# EAGLE design Arduino_Shield_envFollow_vs3 (EAGLE 5.06)
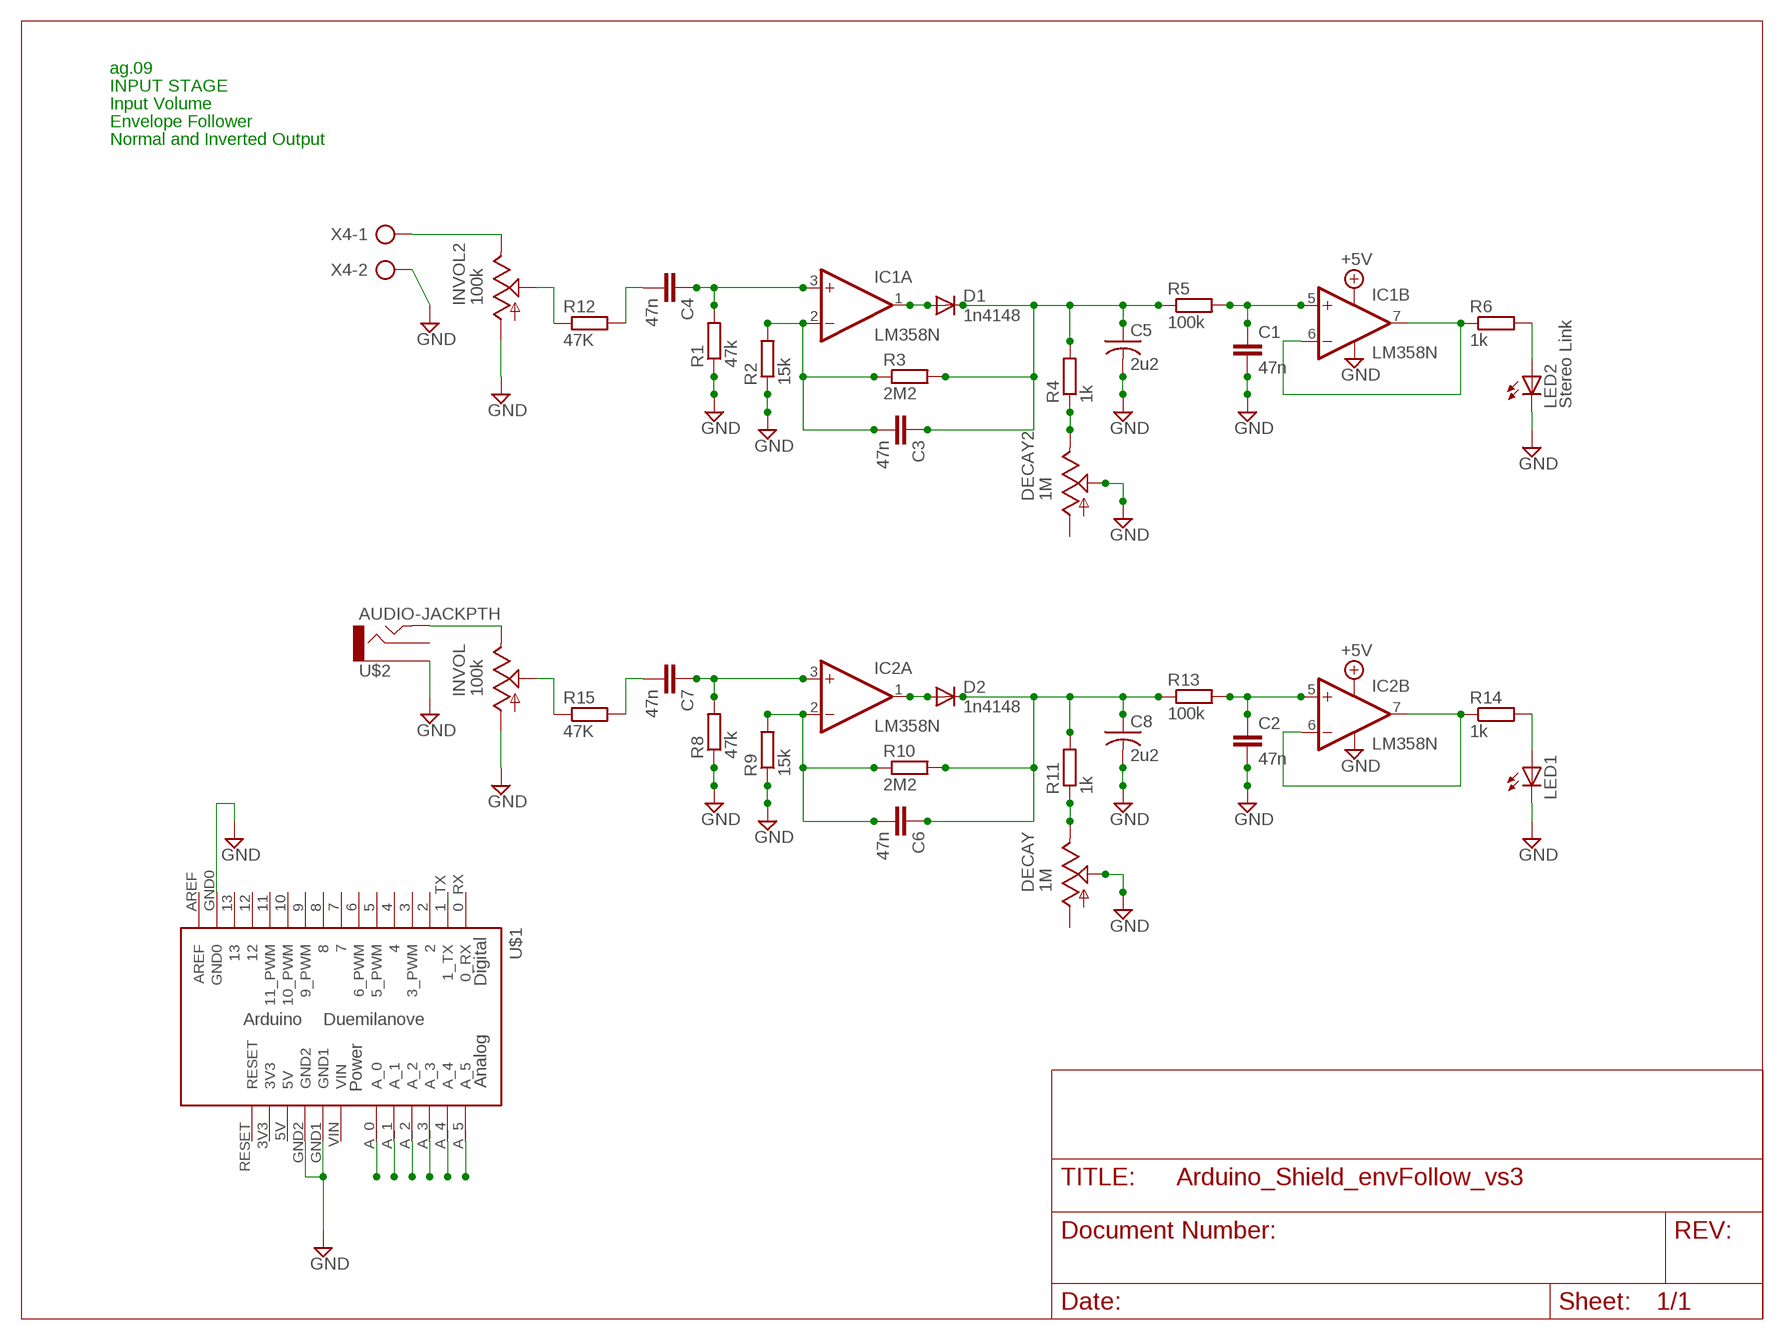
[diagram p0: schematic, sheet 1]

## Parts
C1  47n  C5/3  [C5B3]
C2  47n  C5/3  [C5B3]
C3  47n  C5/3  [C5B3]
C4  47n  C5/3  [C5B3]
C5  2u2  C-US025-050X050  [C025-050X050]
C6  47n  C5/3  [C5B3]
C7  47n  C5/3  [C5B3]
C8  2u2  C-US025-050X050  [C025-050X050]
D1  1n4148  1N4148DO35-7  [DO35-7]
D2  1n4148  1N4148DO35-7  [DO35-7]
DECAY  1M  TRIM_US-ECP10P  [ECP10P]
DECAY2  1M  TRIM_US-ECP10P  [ECP10P]
IC1  LM358N  [DIL08]
IC2  LM358N  [DIL08]
INVOL  100k  TRIM_US-ECP10P  [ECP10P]
INVOL2  100k  TRIM_US-ECP10P  [ECP10P]
LED1  LED3MM  [LED3MM]
LED2  Stereo Link  LED3MM  [LED3MM]
R1  47k  R-EU_0204/7  [0204/7]
R2  15k  R-EU_0204/7  [0204/7]
R3  2M2  R-EU_0204/7  [0204/7]
R4  1k  R-EU_0204/7  [0204/7]
R5  100k  R-EU_0204/7  [0204/7]
R6  1k  R-EU_0204/7  [0204/7]
R8  47k  R-EU_0204/7  [0204/7]
R9  15k  R-EU_0204/7  [0204/7]
R10  2M2  R-EU_0204/7  [0204/7]
R11  1k  R-EU_0204/7  [0204/7]
R12  47K  R-EU_0204/7  [0204/7]
R13  100k  R-EU_0204/7  [0204/7]
R14  1k  R-EU_0204/7  [0204/7]
R15  47K  R-EU_0204/7  [0204/7]
U$1  ARDUINO-USBLONG_PADS_TEXT  [SHIELD]
U$2  AUDIO-JACKPTH  [AUDIO-JACK]
X4  AK300/2  [AK300/2]

## Nets
GND: C1.2 C2.2 C5.2 C8.2 DECAY2.S DECAY.S INVOL2.A INVOL.A LED1.K(C) LED2.K(C) R1.1 R2.1 R8.1 R9.1 U$1.GND0 U$1.GND1 U$1.GND2 U$2.1 X4.2
N$1: D1.A IC1.1(A:OUT)
N$2: C3.2 IC1.2(A:-IN) R2.2 R3.1
N$3: C4.1 IC1.3(A:+IN) R1.2
N$4: C3.1 C5.1 D1.C R3.2 R4.2 R5.1
N$5: C4.2 R12.2
N$6: INVOL2.E X4.1
N$7: DECAY2.E R4.1
N$8: C1.1 IC1.5(B:+IN) R5.2
N$9: IC1.6(B:-IN) IC1.7(B:OUT) R6.1
N$10: LED2.A R6.2
N$11: INVOL2.S R12.1
N$12: D2.A IC2.1(A:OUT)
N$13: C6.2 IC2.2(A:-IN) R9.2 R10.1
N$14: C7.1 IC2.3(A:+IN) R8.2
N$15: C6.1 C8.1 D2.C R10.2 R11.2 R13.1
N$16: DECAY.E R11.1
N$17: C2.1 IC2.5(B:+IN) R13.2
N$18: INVOL.E U$2.5
N$19: LED1.A R14.2
N$20: IC2.6(B:-IN) IC2.7(B:OUT) R14.1
N$21: C7.2 R15.2
N$22: INVOL.S R15.1
N$24: U$1.A_4
N$25: U$1.A_3
N$26: U$1.A_2
N$27: U$1.A_1
N$28: U$1.A_0
N$34: U$1.A_5
Unconnected: DECAY2.A DECAY.A U$1.0_RX U$1.1_TX U$1.2 U$1.3(3_PWM) U$1.4 U$1.5(5_PWM) U$1.6(6_PWM) U$1.7 U$1.8 U$1.9(9_PWM) U$1.10(10_PWM) U$1.11(11_PWM) U$1.12 U$1.13 U$1.AREF U$1.RESET U$2.2

## Notes on the sheet
- ag.09
- INPUT STAGE
- Input Volume
- Envelope Follower
- Normal and Inverted Output

## Power pins joined to a net without a drawn wire
3V3: U$1.3V3
5V: U$1.5V
GND: IC1.4(P:V-) IC2.4(P:V-)
V+: IC1.8(P:V+) IC2.8(P:V+)
VIN: U$1.VIN

## Library data of the parts
C1-C4 C6 C7 = capacitor-wima:C: CAPACITOR naming: grid - package width
C5 C8 = resistor:C-US: CAPACITOR, American symbol
D1 D2 = diode:1N4148: DIODE high speed (Philips)
DECAY DECAY2 INVOL INVOL2 = pot:TRIM_US-: POTENTIOMETER
IC1 IC2 = linear:LM358: OP AMP also LM158; LM258; LM2904 Source: http://cache.national.com/ds/LM/LM158.pdf
LED1 LED2 = led:LED: LED OSRAM: - CHIPLED LG R971, LG N971, LY N971, LG Q971, LY Q971, LO R971, LY R971 LH N974, LH R974 LS Q976, LO Q976, LY Q976 LO Q996 - Hyper CHIPLED LW Q18S LB Q993, LB Q99A, LB R99A - SideLED LS A670, LO A670, LY A670, LG A670, LP A670 LB A673, LV A673, LT A673, LW A673 LH A674 LY A675 LS A676, LA A676, LO A676, LY A676, LW A676 LS A679, LY A679, LG A679 - Hyper Micro SIDELED® LS Y876, LA Y876, LO Y876, LY Y876 LT Y87S - SmartLED LW L88C, LW L88S LB L89C, LB L89S, LG L890 LS L89K, LO L89K, LY L89K LS L896, LA L896, LO L896, LY L896 - TOPLED LS T670, LO T670, LY T670, LG T670, LP T670 LSG T670, LSP T670, LSY T670, LOP T670, LYG T670 LG T671, LOG T671, LSG T671 LB T673, LV T673, LT T673, LW T673 LH T674 LS T676, LA T676, LO T676, LY T676, LB T676, LH T676, LSB T676, LW T676 LB T67C, LV T67C, LT T67C, LS T67K, LO T67K, LY T67K, LW E67C LS E67B, LA E67B, LO E67B, LY E67B, LB E67C, LV E67C, LT E67C LW T67C LS T679, LY T679, LG T679 LS T770, LO T770, LY T770, LG T770, LP T770 LB T773, LV T773, LT T773, LW T773 LH T774 LS E675, LA E675, LY E675, LS T675 LS T776, LA T776, LO T776, LY T776, LB T776 LHGB T686 LT T68C, LB T68C - Hyper Mini TOPLED® LB M676 - Mini TOPLED Santana® LG M470 LS M47K, LO M47K, LY M47K Source: http://www.osram.convergy.de LUXEON: - LUMILED® LXK2-PW12-R00, LXK2-PW12-S00, LXK2-PW14-U00, LXK2-PW14-V00 LXK2-PM12-R00, LXK2-PM12-S00, LXK2-PM14-U00 LXK2-PE12-Q00, LXK2-PE12-R00, LXK2-PE12-S00, LXK2-PE14-T00, LXK2-PE14-U00 LXK2-PB12-K00, LXK2-PB12-L00, LXK2-PB12-M00, LXK2-PB14-N00, LXK2-PB14-P00, LXK2-PB14-Q00 LXK2-PR12-L00, LXK2-PR12-M00, LXK2-PR14-Q00, LXK2-PR14-R00 LXK2-PD12-Q00, LXK2-PD12-R00, LXK2-PD12-S00 LXK2-PH12-R00, LXK2-PH12-S00 LXK2-PL12-P00, LXK2-PL12-Q00, LXK2-PL12-R00 Source: www.luxeon.com KINGBRIGHT: KA-3528ASYC Source: www.kingbright.com
R1-R6 R8-R15 = rcl:R-EU_: RESISTOR, European symbol
U$1 = Arduino-Various:ARDUINO-USB: The Ardiuno Duemilanove Pinouts layoutet as a Bare Shield. v0.5 Also for Arduino Diecimila. This is designed as a Part and has no Outline in the Dimension Layer. The Outline, when present, is drawed at the tPlace / bPlace Layer. Library by Stephanie Lange, http://www.k-ita.de/~sl/
U$2 = SparkFun:AUDIO-JACK: 3.5mm Audio Jack Simple 3.5mm common PCB mount audio jack. SKU: PRT-08032
X4 = con-ptr500:AK300/2: CONNECTOR

## Board
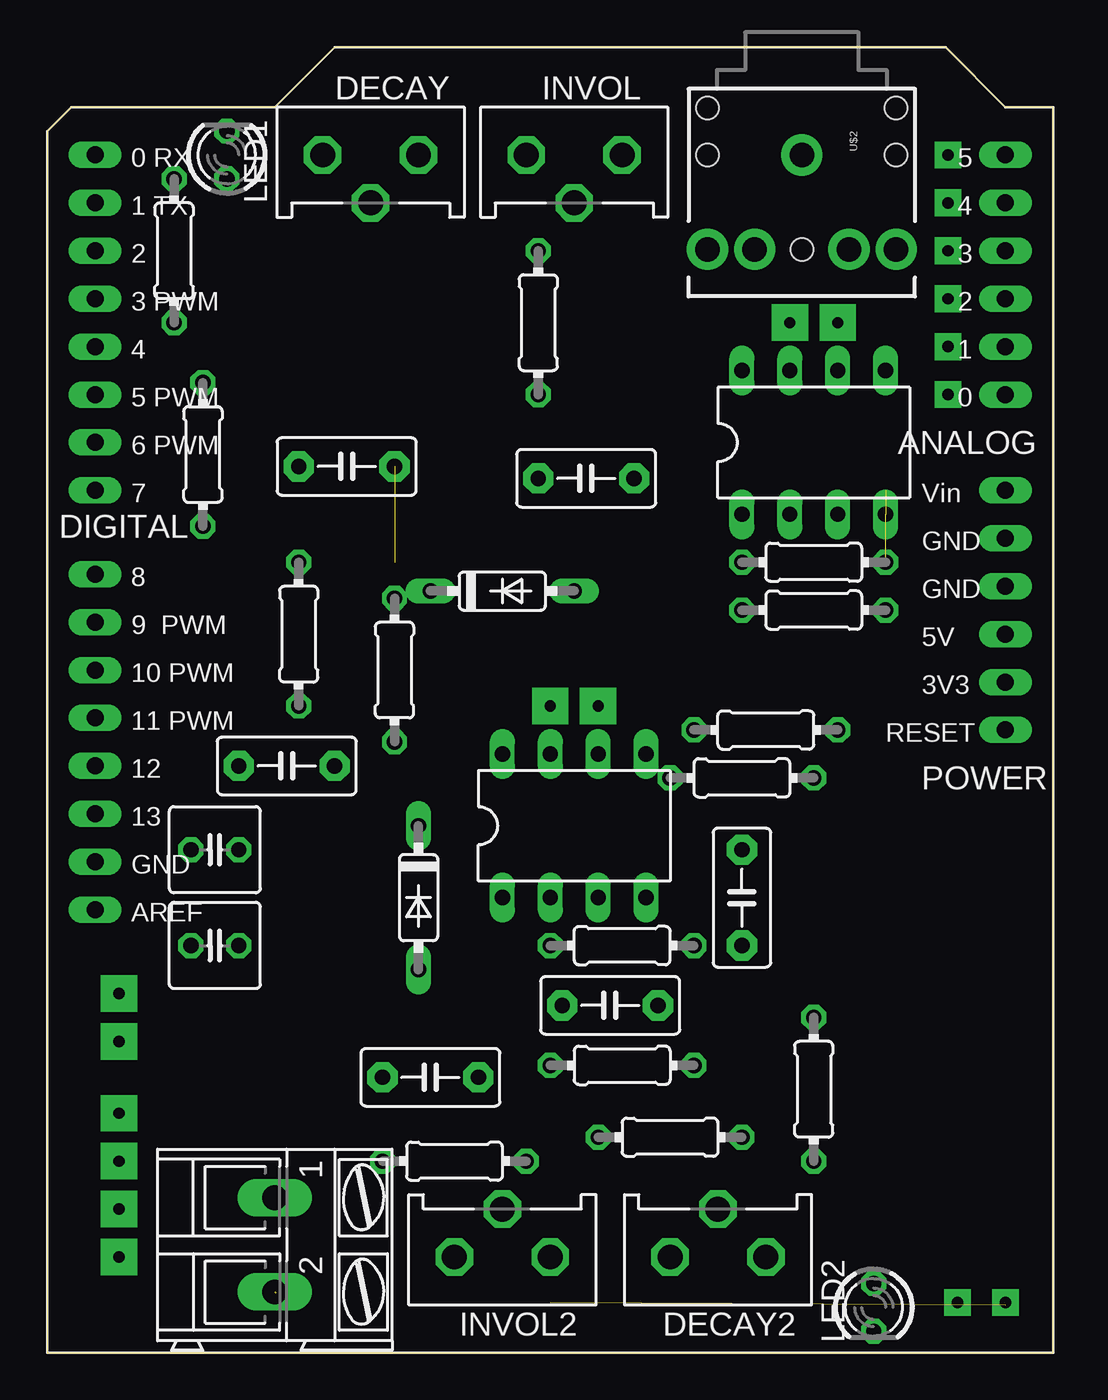
[diagram p1: board, top side]
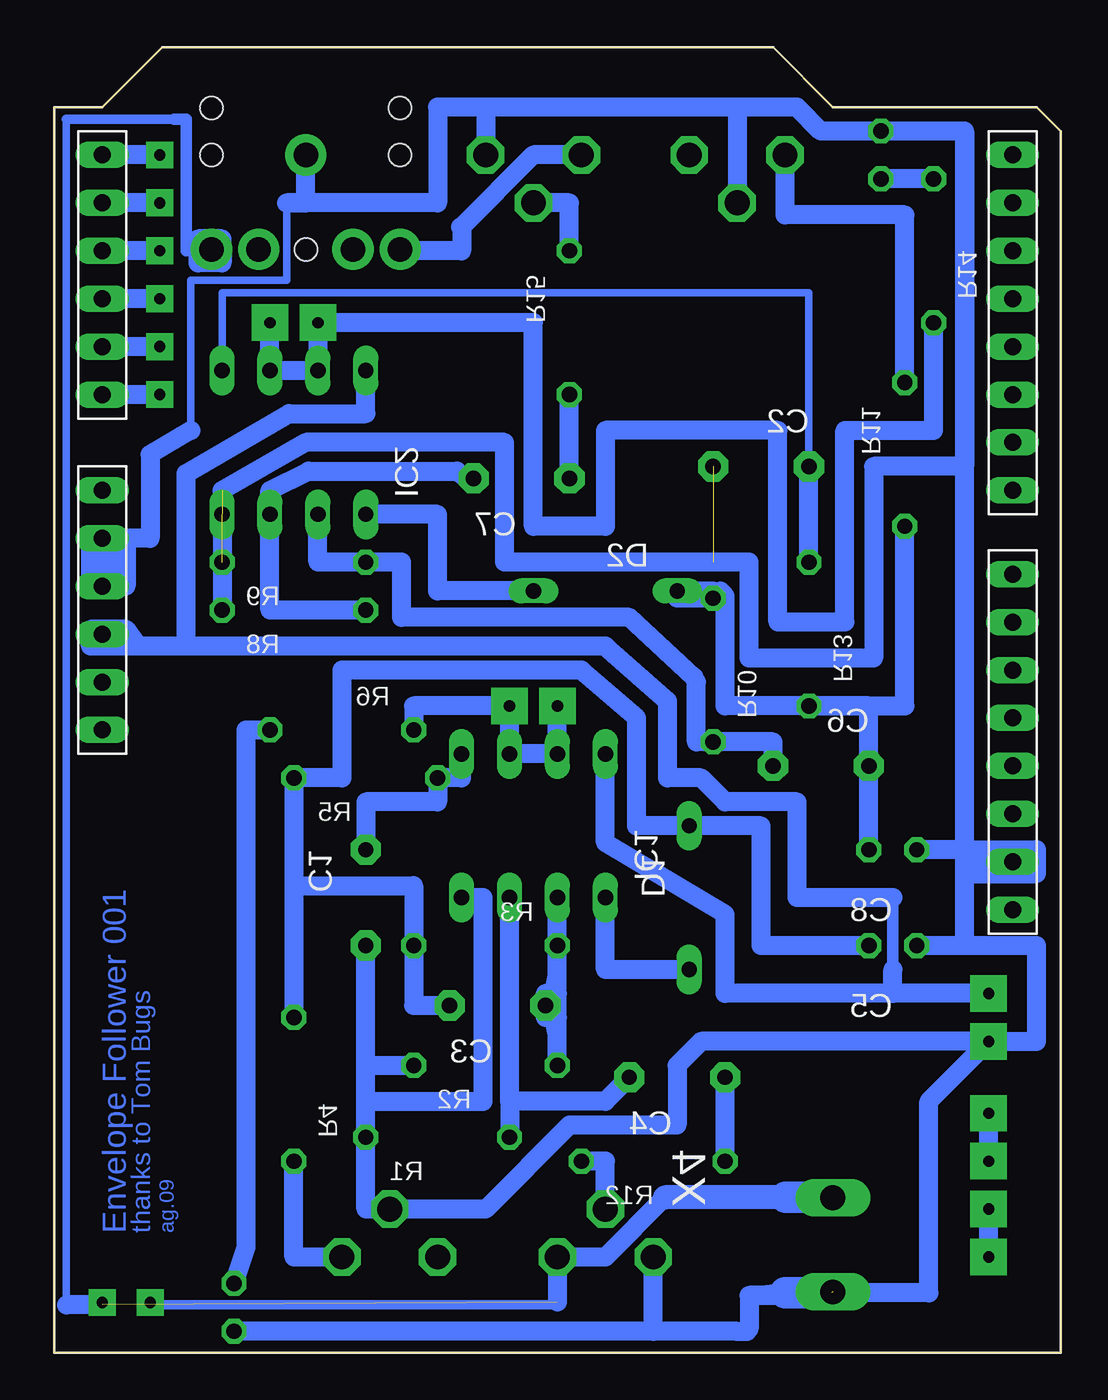
[diagram p2: board, bottom side, seen from below]

Size 53.34 x 69.22 mm. Coordinates in mm from the lower left corner, seen from the top.
Outline: 0,0 53.34,0 53.34,66.04 50.8,66.04 47.62,69.22 15.24,69.22 15.15,69.13 12.06,66.04 1.27,66.04 0,64.77 0,0
Copper layers (1*16): Top 0.035mm / dielectric 1.5mm / Bottom 0.035mm
Design rules "default": minimum track width 10mil, minimum drill 24mil, track to track 8mil, track to pad 8mil, pad to pad 8mil, via to via 8mil, smd to smd 8mil, copper to edge 40mil, drill to drill 8mil, minimum pad ring 10mil, minimum via ring 8mil, stop-mask expansion 4mil, vias tented up to drill 0mil, thermal gap 10mil

### Footprints (pad centres in the part's own frame; a part is rotated, then mirrored left to right if it is on the bottom)
C5B3 = drill 0.813 pad 1.6 octagon: 1 -2.54,0; 2 2.54,0
C025-050X050 = drill 0.813 octagon: 1 -1.27,0; 2 1.27,0
DO35-7 = drill 0.813 long: A 3.81,0; C -3.81,0
ECP10P = drill 1.321 octagon: A -2.54,0; E 2.54,0; S 0,2.54
DIL08 = drill 0.813 long: 1 -3.81,-3.81; 2 -1.27,-3.81; 3 1.27,-3.81; 4 3.81,-3.81; 5 3.81,3.81; 6 1.27,3.81; 7 -1.27,3.81; 8 -3.81,3.81
LED3MM = drill 0.813 octagon: A -1.27,0; K 1.27,0
0204/7 = drill 0.813 octagon: 1 -3.81,0; 2 3.81,0
SHIELD = drill 0.9 pad 1.27 long: 0_RX -25.4,27.94; 1_TX -25.4,25.4; 2 -25.4,22.86; 3 -25.4,20.32; 3V3 22.86,0; 4 -25.4,17.78; 5 -25.4,15.24; 5V 22.86,2.54; 6 -25.4,12.7; 7 -25.4,10.16; 8 -25.4,5.715; 9 -25.4,3.175; 10 -25.4,0.635; 11 -25.4,-1.905; 12 -25.4,-4.445; 13 -25.4,-6.985; A_0 22.86,15.24; A_1 22.86,17.78; A_2 22.86,20.32; A_3 22.86,22.86; A_4 22.86,25.4; A_5 22.86,27.94; AREF -25.4,-12.065; GND0 -25.4,-9.525; GND1 22.86,7.62; GND2 22.86,5.08; RESET 22.86,-2.54; VIN 22.86,10.16
AUDIO-JACK = drill 1.3 pad 2.184 round: 1 0,0; 2 5,5; 3 5,2.5; 4 5,-2.5; 5 5,-5 | hole 1.2: 0,5; -2.5,5; -2.5,-5; 0,-5; 5,0
AK300/2 = drill 1.321 long: 1 -2.515,0; 2 2.489,0

### Placement (x,y rotation side)
C1  36.83,24.13 270 top
C2  15.88,46.99 0 top
C3  29.84,18.42 180 top
C4  20.32,14.61 180 top
C5  8.89,21.59 180 top
C6  12.7,31.12 0 top
C7  28.57,46.36 180 top
C8  8.89,26.67 180 top
D1  19.68,24.13 270 top
D2  24.13,40.39 0 top
DECAY  17.14,63.5 180 top
DECAY2  35.56,5.08 0 top
IC1  27.94,27.94 0 top
IC2  40.64,48.26 0 top
INVOL  27.94,63.5 180 top
INVOL2  24.13,5.08 0 top
LED1  9.53,63.5 90 top
LED2  43.81,2.41 270 top
R1  33.02,11.43 180 top
R2  30.48,15.24 180 top
R3  30.48,21.59 0 top
R4  40.64,13.97 90 top
R5  36.83,30.48 180 top
R6  38.1,33.02 0 top
R8  40.64,39.37 180 top
R9  40.64,41.91 180 top
R10  18.41,36.2 90 top
R11  8.26,47.63 270 top
R12  21.59,10.16 180 top
R13  13.34,38.1 90 top
R14  6.73,58.42 90 top
R15  26.04,54.61 270 top
U$1  27.94,35.56 0 top
U$2  40.01,63.5 270 top
X4  12.06,5.72 270 top

### Tracks (layer width: path | path; a pad name or v marks a point on that pad's centre or on a via)
GND  (via drill 0.6 pad 1.93)  (4 unrouted)
  Bottom 0.406: 41.02,60.96 41.02,56.87 46.1,56.87 46.1,48.9 | 5.08,25.4 2.54,25.4
  Bottom 0.61: 16.51,1.27 17.02,1.27 17.14,1.14
  Bottom 1.016: U$1.GND1 U$1.GND2 U$1.GND1 | 49.53,43.18 48.26,43.18 48.26,47.63 46.1,48.9 | 49.53,43.18 U$1.GND1 | U$1.GND0 5.08,26.04 5.08,26.67 | 5.08,26.67 5.08,64.77 | 5.08,64.77 LED1.K 12.7,64.77 13.97,66.04 17.14,66.04 | 50.16,42.55 50.16,40.64 51.44,40.64 | 49.53,43.18 51.44,43.18 51.44,40.64 | 49.53,43.18 49.53,40.64 51.44,40.64 | 5.08,21.59 1.27,21.59 1.27,16.51 v3.81,16.51 | 5.08,21.59 5.08,25.4 | 5.08,26.67 1.27,26.67 1.27,25.4 5.08,25.4 | 5.08,25.4 5.08,26.67 | 5.08,46.99 9.91,46.99 9.91,36.83 16.51,36.83 16.51,41.91 18.41,41.91 29.46,41.91 29.46,48.26 40.01,48.26 44.45,45.72 R8.1 | 13.21,3 13.97,3.05 15.88,3.05 | 5.08,26.67 5.08,46.99 | 5.08,64.77 5.08,46.99 | 1.91,26.04 4.45,26.04 5.08,26.67 | 15.88,3.05 14.61,3.18 6.99,3.18 6.99,13.34 v3.81,16.51 | 16.63,1.14 17.14,1.14 21.59,1.14 | 15.88,3.05 16.51,3.05 16.51,1.27 | v3.81,16.51 19.05,16.51 20.32,15.24 20.32,12.07 26.04,12.07 30.48,7.62 DECAY2.S 36.83,7.62 R1.1 36.83,13.34 | 41.02,60.96 40,60.95 | 17.14,66.04 30.48,66.04 | 30.48,66.04 33.02,66.04 33.02,60.96 41.02,60.96 | 21.59,1.14 LED2.K | 36.83,13.34 36.83,15.24 | 36.83,15.24 R2.1 | 36.83,15.24 C1.2 | IC1.4 30.61,24.13 30.61,13.34 36.83,13.34 | 5.08,21.59 C5.2 | 5.08,26.67 C8.2 | 17.14,66.04 DECAY.S | 30.48,66.04 INVOL.A | 21.59,1.14 INVOL2.A | 41.02,60.96 40.01,60.96 U$2.1
  Bottom 1.676: 14.61,3.18 12.12,3.18
L  (via drill 0.6 pad 1.42)
  other vias: 48.26,2.67
N$1
  Bottom 1.016: IC1.1 24.13,20.32 D1.A
N$2
  Bottom 0.406: R2.2 C3.2 R3.1 IC1.2
  Bottom 1.016: 26.67,19.05 IC1.2 | 26.67,17.78 26.67,19.05 | R2.2 26.67,17.78 | 26.67,19.05 27.3,19.05 27.3,17.78 26.67,17.78
N$3
  Bottom 1.016: 29.21,13.34 R1.2 | 29.21,13.34 IC1.3 | C4.1 24.13,13.34 29.21,13.34
N$4
  Bottom 0.406: 22.48,27.94 D1.C 15.88,27.94
  Bottom 1.016: C3.1 34.29,18.42 R3.2 34.29,24.77 40.64,24.77 | 40.64,24.77 R5.1 38.1,30.48 38.1,36.2 25.4,36.2 22.48,33.66 22.48,27.94 15.88,27.94 15.88,21.59 C5.1 | 40.64,24.77 R4.2
N$5
  Bottom 1.016: R12.2 C4.2
N$6  (1 unrouted)
  Bottom 0.406: 52.7,2.44 52.7,2.54 52.7,65.41
  Bottom 0.508: 52.7,65.41 46.99,65.41
  Bottom 0.61: 46.99,65.41 46.35,65.41 46.35,58.42 44.45,58.42
  Bottom 1.016: 20.97,8.24 24.13,5.08 INVOL2.E 26.67,2.69 | 50.8,2.54 52.7,2.54 | 44.45,58.42 44.45,59.06 45.72,59.06 45.72,57.79 44.45,57.79 44.45,58.42
  Bottom 1.27: 13.35,8.24 20.97,8.24
  Bottom 1.676: 13.35,8.24 13.34,8.26 14.58,8.26 X4.1
N$7
  Bottom 1.016: R4.1 40.64,5.08 DECAY2.E
N$8
  Bottom 1.016: IC1.5 31.75,30.48 R5.2 33.02,29.21 36.83,29.21 C1.1
N$9  (via drill 0.6 pad 1.93)
  Bottom 1.016: R6.1 34.29,34.29 v29.21,34.29 IC1.6 IC1.7 v26.67,34.29
N$10
  Bottom 1.016: LED2.A 43.18,5.59 43.18,33.02 R6.2
N$11
  Bottom 1.016: R12.1 24.13,10.16 INVOL2.S
N$12
  Bottom 1.016: D2.A 33.02,40.39 33.02,44.45 IC2.1
N$13
  Bottom 0.406: 34.92,41.91 R9.2
  Bottom 1.016: IC2.2 39.37,41.91 34.92,41.91 34.92,38.99 22.86,38.99 19.43,35.81 19.3,35.56 19.3,32.39 R10.1 15.24,32.39 C6.2
N$14
  Bottom 1.016: R8.2 41.91,39.37 IC2.3 41.91,45.72 39.88,46.74 32,46.74 31.5,46.36 C7.1
N$15
  Bottom 0.406: C8.1 C6.1 10.16,34.29 | R10.2 D2.C
  Bottom 1.016: C8.1 10.16,34.29 | 10.16,34.29 R13.1 | R13.1 17.78,34.29 17.78,40.13 18.03,40.39 R10.2 | R10.2 18.41,40.39 D2.C 20.32,40.01 R10.2 | 10.16,34.29 8.26,34.29 | R13.1 8.26,34.29 | 8.26,34.29 R11.2
N$16
  Bottom 1.016: R11.1 8.26,60.33 14.61,60.33 DECAY.E
N$17
  Bottom 0.406: IC2.5 44.45,56.19 13.34,56.19 C2.1
  Bottom 1.016: R13.2 C2.1
N$18
  Bottom 1.016: INVOL.E 27.94,63.5 31.75,59.69 | 31.75,59.69 31.8,59.69 | 31.75,59.69 31.75,58.42 35.01,58.42 U$2.5
N$19
  Bottom 1.016: R14.2 LED1.A
N$20  (via drill 0.6 pad 1.93)
  Bottom 1.016: R14.1 6.73,48.9 11.43,48.9 11.43,38.74 14.99,38.74 14.99,48.9 24.13,48.9 24.13,43.82 27.94,43.82 27.94,54.61 39.37,54.61 IC2.7 IC2.6 v41.91,54.61
N$21
  Bottom 1.016: C7.2 R15.2
N$22
  Bottom 1.016: INVOL.S 26.04,60.96 R15.1
N$23  (via drill 0.6 pad 1.93)
  other vias: 39.37,54.61
N$24  (via drill 0.6 pad 1.42)
  Bottom 0.406: v47.75,60.96 U$1.A_4
  Bottom 1.016: v47.75,60.96 U$1.A_4
N$25  (via drill 0.6 pad 1.42)
  Bottom 0.406: v47.75,58.42 U$1.A_3
  Bottom 1.016: v47.75,58.42 U$1.A_3
N$26  (via drill 0.6 pad 1.42)
  Bottom 0.406: v47.75,55.88 U$1.A_2
  Bottom 1.016: v47.75,55.88 U$1.A_2
N$27  (via drill 0.6 pad 1.42)
  Bottom 0.406: v47.75,53.34 U$1.A_1
  Bottom 1.016: v47.75,53.34 U$1.A_1
N$28  (via drill 0.6 pad 1.42)
  Bottom 0.406: v47.75,50.8 U$1.A_0
  Bottom 1.016: v47.75,50.8 U$1.A_0
N$29
  Bottom 0.508: 26.92,2.54 48.01,2.54
  Bottom 0.61: 48.26,2.54 48.01,2.54 47.75,2.54
N$30  (via drill 0.6 pad 1.93)
  Bottom 1.016: v3.81,10.16 v3.81,12.7
N$32  (via drill 0.6 pad 1.93)
  Bottom 1.016: v3.81,5.08 v3.81,7.62
N$34  (via drill 0.6 pad 1.42)
  Bottom 0.406: v47.75,63.5 U$1.A_5
  Bottom 1.016: v47.75,63.5 U$1.A_5
N$35  (via drill 0.6 pad 1.42)
  other vias: 50.8,2.67
V+  (via drill 0.6 pad 1.93)
  Bottom 0.61: 8.89,20.32 8.89,24.13
  Bottom 1.016: 8.89,19.05 8.89,20.32 | 8.89,19.05 17.78,19.05 17.78,23.24 24.13,27.05 IC1.8 | 8.89,24.13 13.97,24.13 13.97,29.21 17.78,29.21 19.05,30.48 20.83,30.48 20.83,34.54 24.13,37.47 46.35,37.47 | v3.81,19.05 8.89,19.05 | 48.9,37.47 49.53,38.35 51.44,38.35 51.44,37.47 48.9,37.47 | 46.35,37.47 46.35,46.61 40.89,49.78 36.83,49.78 IC2.8 | 46.35,37.47 48.9,37.47

### Text on the board
Bottom: ag.09 | thanks to Tom Bugs | Envelope Follower 001
TOPprint: +5v | G